# EAGLE design main (EAGLE 9.3.1)
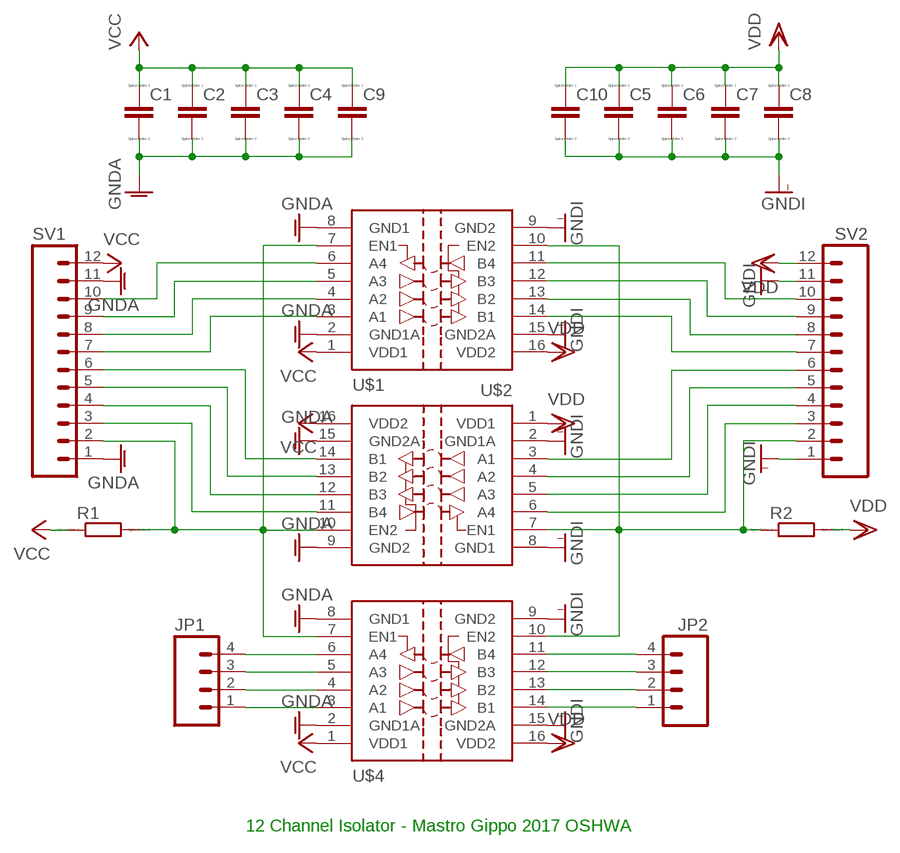
[diagram p0: schematic, sheet 1]

## Parts
C1  C-EUC0805K  [C0805K]
C2  C-EUC0805K  [C0805K]
C3  C-EUC0805K  [C0805K]
C4  C-EUC0805K  [C0805K]
C5  C-EUC0805K  [C0805K]
C6  C-EUC0805K  [C0805K]
C7  C-EUC0805K  [C0805K]
C8  C-EUC0805K  [C0805K]
C9  C-EUC0805K  [C0805K]
C10  C-EUC0805K  [C0805K]
JP1  M04LONGPADS  [1X04_LONGPADS]
JP2  M04LONGPADS  [1X04_LONGPADS]
R1  R-EU_M0805  [M0805]
R2  R-EU_M0805  [M0805]
SV1  M12LONGPADS  [1X12_LONGPADS]
SV2  M12LONGPADS  [1X12_LONGPADS]
U$1  SI8441IS  [SO16W]
U$2  SI8441IS  [SO16W]
U$4  SI8441IS  [SO16W]

## Nets
GNDA: C1.2 C2.2 C3.2 C4.2 C9.2 SV1.1 SV1.11 U$1.2(GND1A) U$1.8(GND1) U$2.9(GND2) U$2.15(GND2A) U$4.2(GND1A) U$4.8(GND1)
GNDI: C5.2 C6.2 C7.2 C8.2 C10.2 SV2.1 SV2.11 U$1.9(GND2) U$1.15(GND2A) U$2.2(GND1A) U$2.8(GND1) U$4.9(GND2) U$4.15(GND2A)
N$1: SV1.10 U$1.6(A4)
N$2: SV1.9 U$1.5(A3)
N$3: SV1.8 U$1.4(A2)
N$4: SV1.7 U$1.3(A1)
N$5: R1.2 SV1.2 U$1.7(EN1) U$2.10(EN2) U$4.7(EN1)
N$6: R2.1 SV2.2 U$1.10(EN2) U$2.7(EN1) U$4.10(EN2)
N$7: SV1.6 U$2.14(B1)
N$8: SV1.5 U$2.13(B2)
N$9: SV1.4 U$2.12(B3)
N$10: SV1.3 U$2.11(B4)
N$11: SV2.9 U$1.12(B3)
N$12: SV2.8 U$1.13(B2)
N$13: SV2.10 U$1.11(B4)
N$14: SV2.7 U$1.14(B1)
N$15: SV2.6 U$2.3(A1)
N$16: SV2.5 U$2.4(A2)
N$17: SV2.4 U$2.5(A3)
N$18: SV2.3 U$2.6(A4)
N$19: JP1.1 U$4.3(A1)
N$20: JP1.2 U$4.4(A2)
N$21: JP1.3 U$4.5(A3)
N$22: JP1.4 U$4.6(A4)
N$23: JP2.1 U$4.14(B1)
N$24: JP2.2 U$4.13(B2)
N$25: JP2.3 U$4.12(B3)
N$26: JP2.4 U$4.11(B4)
VCC: C1.1 C2.1 C3.1 C4.1 C9.1 R1.1 SV1.12 U$1.1(VDD1) U$2.16(VDD2) U$4.1(VDD1)
VDD: C5.1 C6.1 C7.1 C8.1 C10.1 R2.2 SV2.12 U$1.16(VDD2) U$2.1(VDD1) U$4.16(VDD2)

## Notes on the sheet
- 12 Channel Isolator - Mastro Gippo 2017 OSHWA

## Library data of the parts
C1-C10 = resistor:C-EU: CAPACITOR, European symbol; SPICEPREFIX: C
JP1 JP2 = SparkFun-Connectors:M04: Header 4 Standard 4-pin 0.1" header. Use with straight break away headers (SKU : PRT-00116), right angle break away headers (PRT-00553), swiss pins (PRT-00743), machine pins (PRT-00117), and female headers (PRT-00115). Molex polarized connector foot print use with SKU : PRT-08231 with associated crimp pins and housings. 1MM SMD Version SKU: PRT-10208
R1 R2 = resistor:R-EU_: RESISTOR, European symbol; SPICEPREFIX: R
SV1 SV2 = SparkFun-Connectors:M12: Header 12 Standard 12-pin 0.1" header. Use with straight break away headers (SKU : PRT-00116), right angle break away headers (PRT-00553), swiss pins (PRT-00743), machine pins (PRT-00117), and female headers (PRT-00115).
U$1 U$2 U$4 = silicon-labs:SI8441: Si8441 4 Channel (3/1) Digital Isolator Silicon Labs Si84xx ISOpro digital isolator series. The Si84xx ISOpro digital isolators provide low power galvanic isolation for digital signals. The '41 has three forward and one reverse channel, with output enables. This part is suitable for four wire SPI: unidirectional signals with clock and chip select. They come in speeds of 1Mbps and 150Mbps, and isolation ratings of 1KV, 2.5KV and 5KV. The independent sides use 2.7-5.5V supplies and draw under 5mA per channel. Donald Becker

## Board
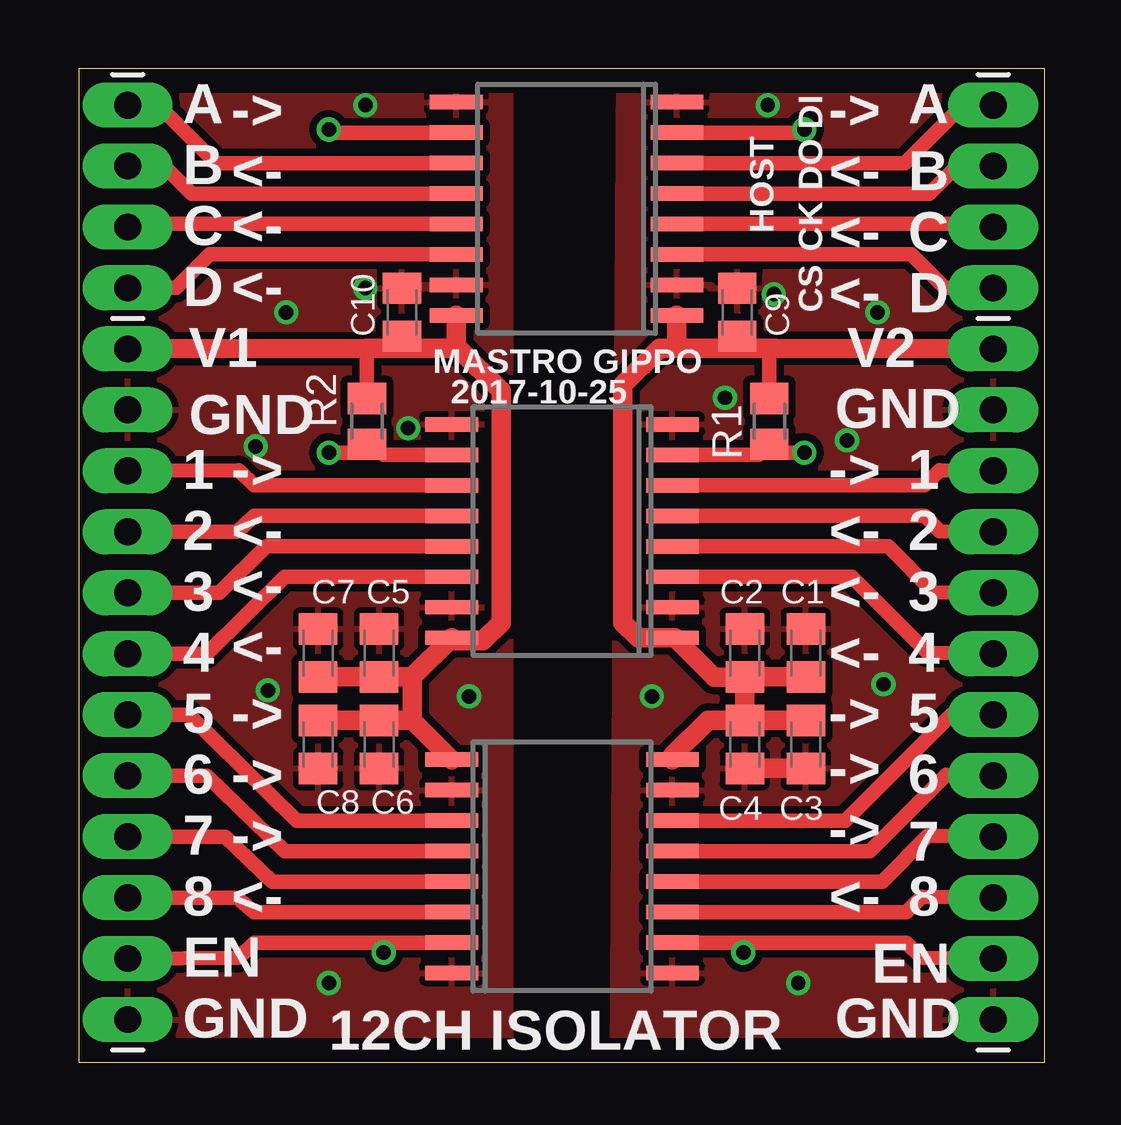
[diagram p1: board, top side]
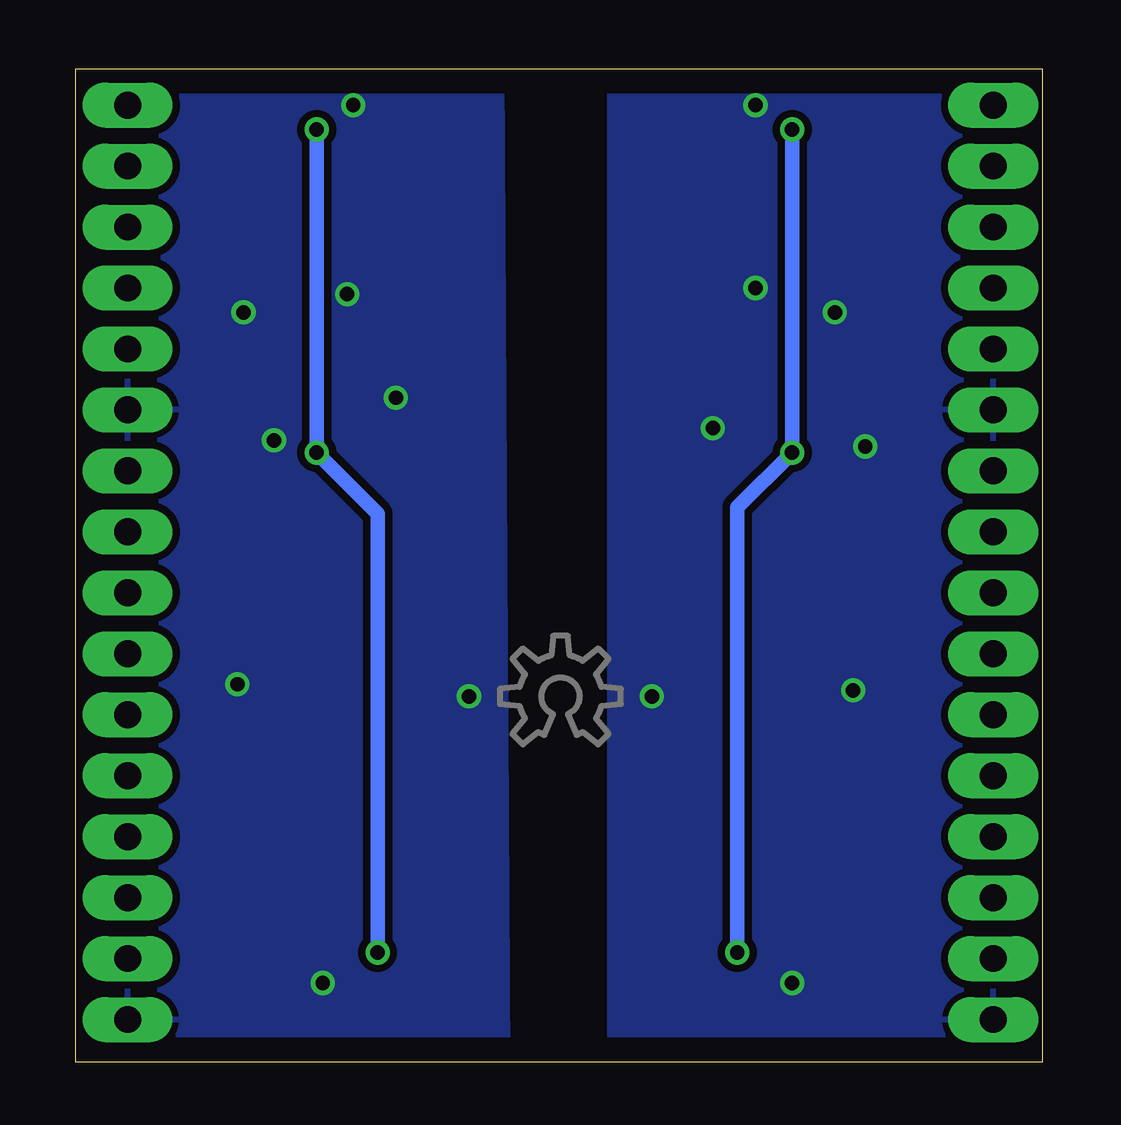
[diagram p2: board, bottom side, seen from below]

Size 40.25 x 41.4 mm. Coordinates in mm from the lower left corner, seen from the top.
Outline: 0,0 40.25,0 40.25,41.4 0,41.4 0,0
Copper layers (1*16): Top 0.035mm / dielectric 1.5mm / Bottom 0.035mm
Design rules "default": minimum track width 10mil, minimum drill 24mil, track to track 8mil, track to pad 8mil, pad to pad 8mil, via to via 8mil, smd to smd 8mil, copper to edge 40mil, drill to drill 8mil, minimum pad ring 10mil, minimum via ring 8mil, stop-mask expansion 4mil, vias tented up to drill 0mil, thermal gap 10mil

### Footprints (pad centres in the part's own frame; a part is rotated, then mirrored left to right if it is on the bottom)
C0805K = smd 1.3 x 1.6: 1 -1,0; 2 1,0
1X04_LONGPADS = drill 1.118 pad 1.88 long: 1 0,0; 2 2.54,0; 3 5.08,0; 4 7.62,0
M0805 = smd 1.3 x 1.6: 1 -0.95,0; 2 0.95,0
1X12_LONGPADS = drill 1.118 pad 1.88 long: 1 0,0; 2 2.54,0; 3 5.08,0; 4 7.62,0; 5 10.16,0; 6 12.7,0; 7 15.24,0; 8 17.78,0; 9 20.32,0; 10 22.86,0; 11 25.4,0; 12 27.94,0
SO16W = smd 0.6 x 2.2: 1 -4.445,-4.6; 2 -3.175,-4.6; 3 -1.905,-4.6; 4 -0.635,-4.6; 5 0.635,-4.6; 6 1.905,-4.6; 7 3.175,-4.6; 8 4.445,-4.6; 9 4.445,4.6; 10 3.175,4.6; 11 1.905,4.6; 12 0.635,4.6; 13 -0.635,4.6; 14 -1.905,4.6; 15 -3.175,4.6; 16 -4.445,4.6

### Placement (x,y rotation side)
C1  30.29,17.05 90 top
C2  27.75,17.05 90 top
C3  30.29,13.24 270 top
C4  27.75,13.24 270 top
C5  12.51,17.05 90 top
C6  12.51,13.24 270 top
C7  9.97,17.05 90 top
C8  9.97,13.24 270 top
C9  27.43,31.24 90 top
C10  13.46,31.24 90 top
JP1  38.1,32.26 90 top
JP2  2.03,32.26 90 top
R1  28.77,26.7 270 top
R2  12,26.7 90 top
SV1  38.1,1.78 90 top
SV2  2.03,1.78 90 top
U$1  20.13,22.13 90 top
U$2  20.13,8.16 270 top
U$3  [OSHWLOGO_TOL_0.2]  20.07,15.24 0 bottom
U$4  20.32,35.56 90 top

### Tracks (layer width: path | path; a pad name or v marks a point on that pad's centre or on a via)
GNDA  (via drill 0.6)
  Top 0.813: C4.2 C3.2
  other vias: 32,25.91 33.53,15.75 29.97,3.3 23.88,15.24 28.96,32 28.7,39.88 26.92,27.69 33.27,31.24
  pour Top (isolate 0.305): 22.51,41.4 40.25,41.4 40,0 22.25,0
  pour Bottom (isolate 0.305): 22.51,41.4 40.25,41.4 40,0 22.25,0
GNDI  (via drill 0.6)
  other vias: 7.37,25.65 13.72,26.42 7.87,15.49 16.26,15.24 10.41,3.3 11.94,32.26 11.94,39.88 8.64,31.24
  pour Top (isolate 0.305): 0,41.4 0,0 18,0 18,41.4
  pour Bottom (isolate 0.305): 0,41.4 0,0 18,0 18,41.4
N$1
  Top 0.61: U$1.6 35.24,24.04 35.88,24.67 SV1.10
N$2
  Top 0.61: U$1.5 35.24,22.77 35.88,22.13 SV1.9
N$3
  Top 0.61: U$1.4 33.72,21.5 35.62,19.59 SV1.8
N$4
  Top 0.61: U$1.3 32.2,20.23 35.37,17.05 SV1.7
N$5  (via drill 0.6)
  Top 0.61: SV1.2 35.12,4.35 34.48,4.99 U$2.10 27.27,4.99 v27.69,4.57 | U$1.7 28.32,25.3 R1.2 29.12,25.4 v30.23,25.4 | U$4.7 29.84,38.73 v30.23,38.86
  Bottom 0.61: v27.69,4.57 27.69,22.86 v30.23,25.4 v30.23,38.86
N$6  (via drill 0.6)
  Top 0.61: SV2.2 6.67,4.35 7.3,4.99 U$2.7 13.11,4.99 v12.7,4.57 | U$1.10 12.7,25.3 R2.1 11.65,25.4 v10.41,25.4 | U$4.10 10.54,38.73 v10.41,38.86
  Bottom 0.61: v12.7,4.57 12.7,23.11 v10.41,25.4 v10.41,38.86
N$7
  Top 0.61: U$2.14 31.94,10.06 36.39,14.51 SV1.6
N$8
  Top 0.61: U$2.13 32.96,8.79 36.13,11.97 SV1.5
N$9
  Top 0.61: U$2.12 33.47,7.53 35.37,9.43 SV1.4
N$10
  Top 0.61: U$2.11 34.48,6.25 35.12,6.89 SV1.3
N$11
  Top 0.61: U$1.12 7.3,22.77 6.6,22.1 SV2.9
N$12
  Top 0.61: U$1.13 7.81,21.5 5.84,19.56 SV2.8
N$13
  Top 0.61: U$1.11 7.3,24.04 6.67,24.67 SV2.10
N$14
  Top 0.61: U$1.14 8.57,20.23 5.33,17.02 SV2.7
N$15
  Top 0.61: U$2.3 9.08,10.06 4.57,14.48 SV2.6
N$16
  Top 0.61: U$2.4 8.57,8.79 5.33,11.94 SV2.5
N$17
  Top 0.61: U$2.5 8.06,7.53 6.1,9.4 SV2.4
N$18
  Top 0.61: U$2.6 7.3,6.25 6.6,6.86 SV2.3
N$19
  Top 0.61: U$4.3 34.67,33.66 36.07,32.26 JP1.1
N$20
  Top 0.61: U$4.4 37.97,34.92 JP1.2
N$21
  Top 0.61: U$4.5 35.43,36.2 36.58,37.34 JP1.3
N$22
  Top 0.61: U$4.6 34.42,37.47 36.83,39.88 JP1.4
N$23
  Top 0.61: U$4.14 5.46,33.66 4.06,32.26 JP2.1
N$24
  Top 0.61: U$4.13 2.41,34.92 2.29,34.8 JP2.2
N$25
  Top 0.61: U$4.12 4.7,36.2 3.56,37.34 JP2.3
N$26
  Top 0.61: U$4.11 5.71,37.47 3.43,39.75 3.3,39.88 JP2.4
VCC
  Top 0.61: R1.1 28.77,29.5 29.02,29.75 | C9.1 27.43,29.75
  Top 0.813: 27.73,16.03 26.48,16.03 24.83,17.68 U$1.1 23.3,17.68 22.67,18.32 22.67,28.23 24.19,29.75 24.89,29.75 | U$2.16 24.73,12.76 26.23,14.26 27.73,14.26 | 27.73,14.26 C4.1 C3.1 | SV1.12 29.02,29.75 27.43,29.75 24.89,29.75 | 27.73,14.26 27.73,16.03 | 27.73,16.03 C2.1 C1.1 | U$4.1 24.92,29.78 24.89,29.75
VDD
  Top 0.61: R2.2 12,29.75 | C10.1 13.46,30 13.72,29.75
  Top 0.813: C7.1 C5.1 13.89,16.05 | C8.1 C6.1 13.89,14.24 | 13.89,14.24 U$2.1 | 13.89,16.05 U$1.16 15.66,17.56 16.83,17.56 17.59,18.32 17.59,27.97 15.81,29.75 15.49,29.75 | SV2.12 12,29.75 13.72,29.75 15.49,29.75 | 13.89,14.24 13.89,16.05 | U$4.16 15.72,29.98 15.49,29.75

### Text on the board
tNames: A | -> | DI | -> | A | B | <- | DO | <- | B | HOST | C | <- | CK | <- | C | D | <- | CS | <- | D | V1 | MASTRO GIPPO | V2 | 2017-10-25 | GND | GND | 1 | -> | -> | 1 | 2 | <- | <- | 2 | 3 | <- | <- | 3 | <- | 4 | <- | 4 | 5 | -> | -> | 5 | 6 | -> | -> | 6 | 7 | -> | -> | 7 | 8 | <- | <- | 8 | EN | EN | GND | 12CH ISOLATOR | GND